# Altium schematic sheet Control.SchDoc
size A4; SheetNumber: 2; SheetTotal: 4
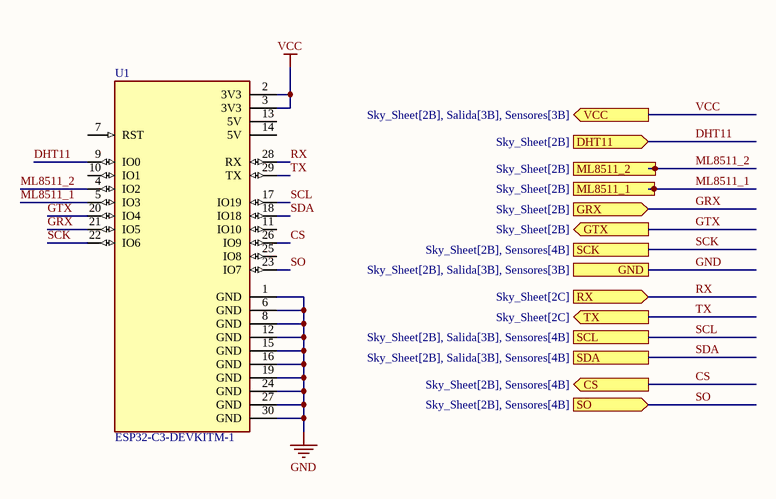
[diagram p0: Control.SchDoc]

## Parts
U1  ESP32-C3-DEVKITM-1  [XCVR_ESP32-C3-DEVKITM-1]

## Ports
CS (out, see Sky_Sheet[2B], Sensores[4B]), DHT11 (in, see Sky_Sheet[2B]), GND (see Sky_Sheet[2B], Salida[3B], Sensores[3B]), GRX (in, see Sky_Sheet[2B]), GTX (out, see Sky_Sheet[2B]), ML8511_1 (in, see Sky_Sheet[2B]), ML8511_2 (in, see Sky_Sheet[2B]), RX (in, see Sky_Sheet[2C]), SCK (see Sky_Sheet[2B], Sensores[4B]), SCL (see Sky_Sheet[2B], Salida[3B], Sensores[4B]), SDA (see Sky_Sheet[2B], Salida[3B], Sensores[4B]), SO (in, see Sky_Sheet[2B], Sensores[4B]), TX (out, see Sky_Sheet[2C]), VCC (out, see Sky_Sheet[2B], Salida[3B], Sensores[3B])

## Nets
GND: U1.1(GND) U1.6(GND) U1.8(GND) U1.12(GND) U1.15(GND) U1.16(GND) U1.19(GND) U1.24(GND) U1.27(GND) U1.30(GND) ; port GND
VCC: U1.2(3V3) U1.3(3V3) ; port VCC
CS: U1.26(IO9) ; port CS
DHT11: U1.9(IO0) ; port DHT11
GRX: U1.21(IO5) ; port GRX
GTX: U1.20(IO4) ; port GTX
ML8511_1: U1.5(IO3) ; port ML8511_1
ML8511_2: U1.4(IO2) ; port ML8511_2
RX: U1.28(RX) ; port RX
SCK: U1.22(IO6) ; port SCK
SCL: U1.17(IO19) ; port SCL
SDA: U1.18(IO18) ; port SDA
SO: U1.23(IO7) ; port SO
TX: U1.29(TX) ; port TX

Not connected (* = marked no-connect by the designer): U1 7(RST) 10(IO1) 11(IO10) 13(5V) 14(5V) 25(IO8)

## Library data of the parts
U1 = ESP32-C3-DEVKITM-1: WiFi Development Tools (802.11) (ENGINEERING SAMPLE ONLY) ESP32-C3 General-Purpose Dev Board, Embeds ESP32-C3-MINI-1, 4 MB Flash, w/ Pin Header; MF: Espressif Systems; SnapEDA_Link: https://www.snapeda.com/parts/ESP32-C3-DEVKITM-1/Espressif+Systems/view-part/?ref=snap; Package: None; Value: *; MP: ESP32-C3-DEVKITM-1; Check_prices: https://www.snapeda.com/parts/ESP32-C3-DEVKITM-1/Espressif+Systems/view-part/?ref=eda